# Altium schematic sheet MEGA2560_Rev3e_1.SchDoc: MEGA2560_Rev3e
size 409 x 289 mm; Origin: Eagle; Date: 23/01/2019 12:57:19; SheetNumber: 2; CODE-ARDUINO: DNP; DATASHEET: DNP; DISTRIBUTOR-LINK: DNP; DISTRIBUTOR-PN: DNP; MANUFACTURER: DNP; MANUFACTURER-PN: DNP; NOTE: DNP; Value: DNP; GateName_1: G$1; SymbolName_1: A3L-LOC; LibraryName: Arduino-utility; DeviceSetName: A3-FRAME; Sheet: Sheet:; ReferenceDesignsAREPROVIDED"ASIS"AND"WITHALLFAULTS.ArduinoSADISCLAIMSALLOTHERWARRANTIES,EXPRESSORIMPLIED,
REGARDINGPRODUCTS,INCLUDINGBUTNOTLIMITEDTO,ANYIMPLIEDWARRANTIESOFMERCHANTABILITYORFITNESSFORAPARTICULARPURPOSE

ArduinoSAmaymakechangestospecificationsandproductdescriptionsatanytime,withoutnotice.TheCustomermustnot
relyontheabsenceorcharacteristicsofanyfeaturesorinstructionsmarked"reserved"or"undefined."ArduinoSAreserves
theseforfuturedefinitionandshallhavenoresponsibilitywhatsoeverforconflictsorincompatibilitiesarisingfromfuturechangestothem.
TheproductinformationontheWebSiteorMaterialsissubjecttochangewithoutnotice.Donotfinalizeadesignwiththisinfo

ARDUINOandotherArduinobrandsandlogosandTrademarksofArduinoSA.AllArduinoSATrademarkscannotbeusedwithoutowner'sformalpermission: Reference Designs ARE PROVIDED "AS IS" AND "WITH ALL FAULTS. Arduino SA DISCLAIMS ALL OTHER WARRANTIES, EXPRESS OR IMPLIED, / REGARDING PRODUCTS, INCLUDING BUT NOT LIMITED TO, ANY IMPLIED WARRANTIES OF MERCHANTABILITY OR FITNESS FOR A PARTICULAR PURPOSE / Arduino SA may make changes to specifications and product descriptions at any time, without notice. The Customer must not / rely on the absence or characteristics of any features or instructions marked "reserved" or "undefined." Arduino SA reserves / these for future definition and shall have no responsibility whatsoever for conflicts or incompatibilities arising from future changes to them. / The product information on the Web Site or Materials is subject to change without notice. Do not finalize a design with this info / ARDUINO and other Arduino brands and logos and Trademarks of Arduino SA. All Arduino SA Trademarks cannot be used without owner's formal permission
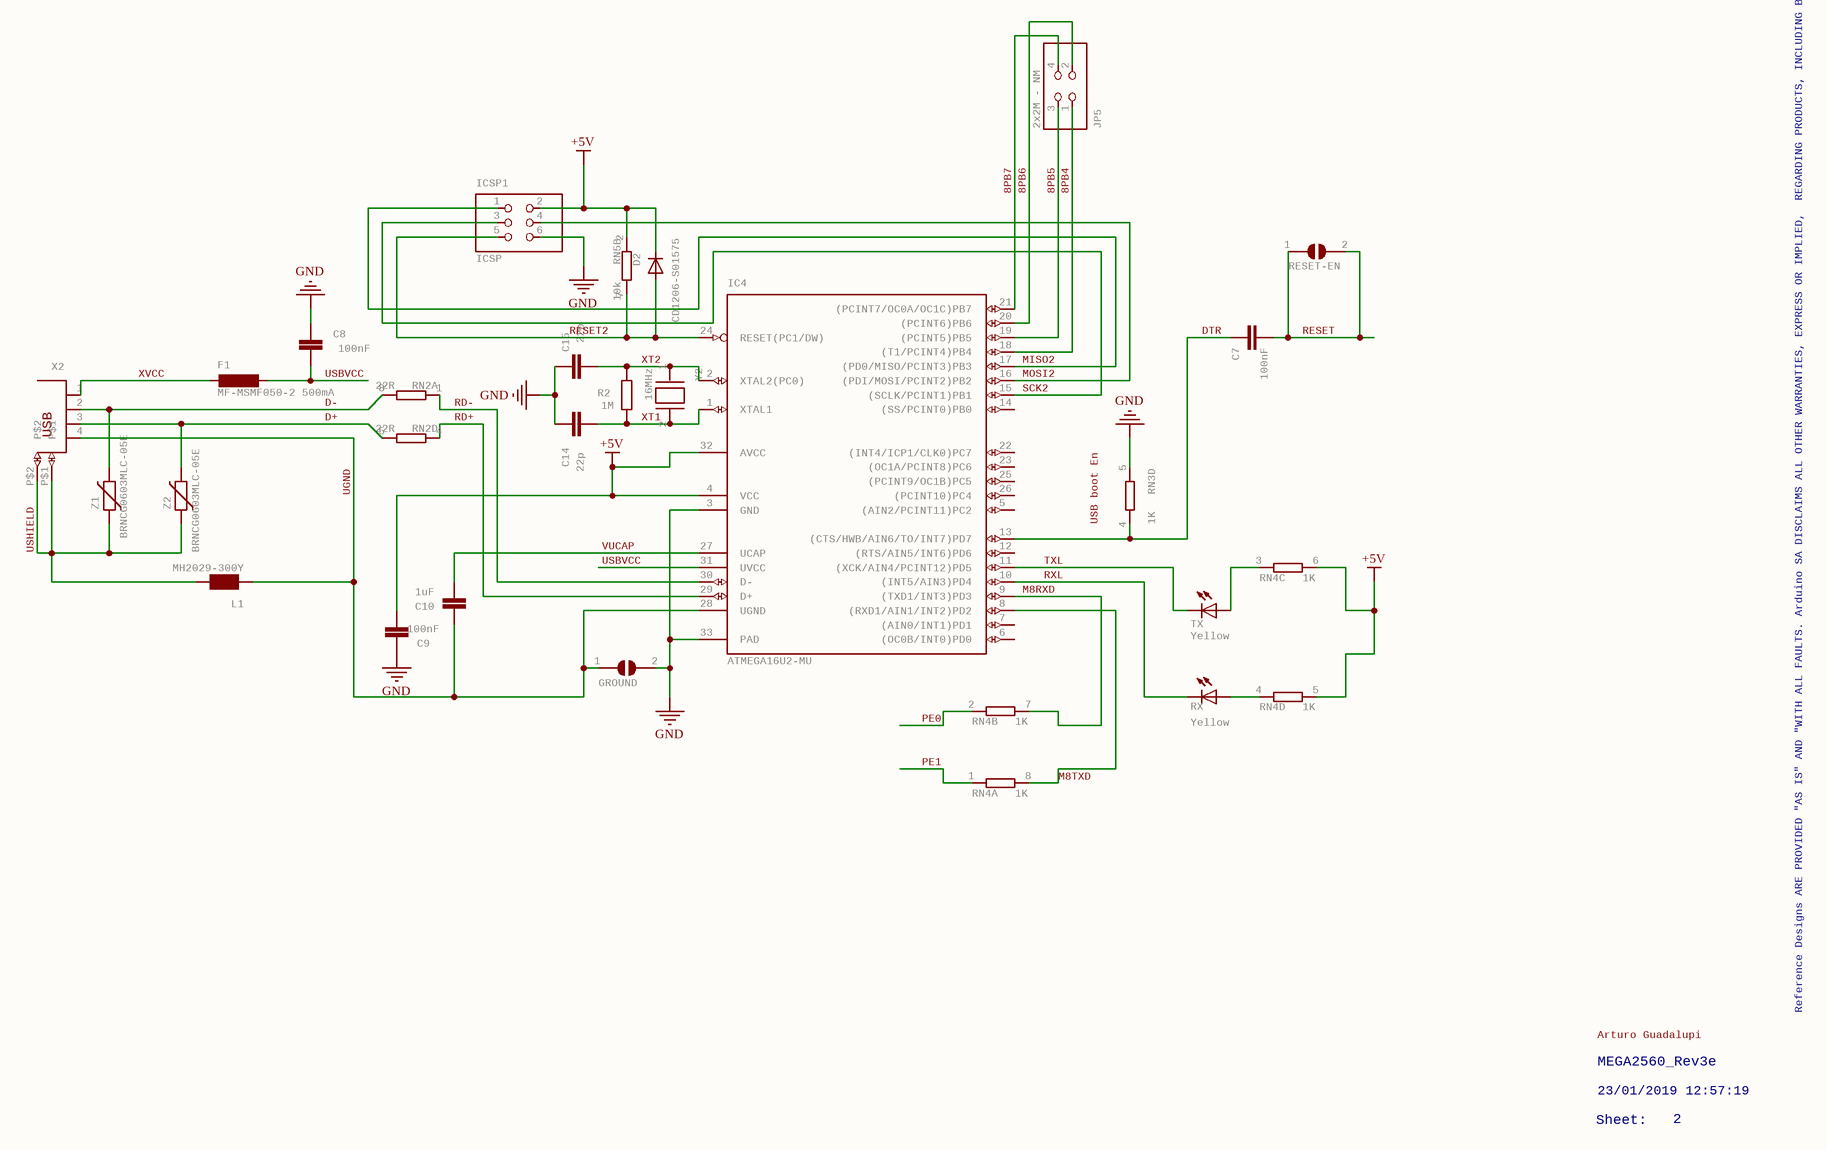
[diagram p0: MEGA2560_Rev3e_1.SchDoc]

## Parts
C7  100nF  [C0603-ROUND]
C8  100nF  [C0603-ROUND]
C9  100nF  [C0603-ROUND]
C10  1uF  [C0603-ROUND]
C14  22p  [C0603-ROUND]
C15  22p  [C0603-ROUND]
D2  CD1206-S01575  [MINIMELF]
F1  MF-MSMF050-2 500mA  [L1812]
GROUND  SJ  [SJ]  (value not drawn)
IC4  ATMEGA16U2-MU  [MLF32]
ICSP1  ICSP  [2X03]
JP5  2x2M - NM  [2X02]
L1  MH2029-300Y  [0805]
R2  1M  [R0603-ROUND]
RESET-EN  SJ  [SJ]  (value not drawn)
RN2  22R  [CAY16]  (parts A,D of 4)
RN3  1K  [CAY16]  (part D of 4)
RN4  1K  [CAY16]  (parts A,B,C,D of 4)
RN5  10k  [CAY16]  (part B of 4)
RX  Yellow  [CHIPLED_0805]
TX  Yellow  [CHIPLED_0805]
X2  0056_USB-B-S-RA-WT-SPCC  [PN61729]  (value not drawn)
Y2  16MHz  [QS]
Z1  BRNCG0603MLC-05E  [CT/CN0603]
Z2  BRNCG0603MLC-05E  [CT/CN0603]

## Nets
+5V: C9.1 D2.C IC4.4(VCC) IC4.32(AVCC) ICSP1.2 RN4.5 RN4.6 RN5.2
GND: C8.2 C9.2 C14.2 C15.2 GROUND.2 IC4.3(GND) IC4.33(PAD) ICSP1.6 RN3.5
8PB4: IC4.18((T1/PCINT4)PB4) JP5.1
8PB5: IC4.19((PCINT5)PB5) JP5.3
8PB6: IC4.20((PCINT6)PB6) JP5.2
8PB7: IC4.21((PCINT7/OC0A/OC1C)PB7) JP5.4
D+: RN2.5 X2.3 Z2.2
D-: RN2.8 X2.2 Z1.2
DTR: C7.1 IC4.13((CTS/HWB/AIN6/TO/INT7)PD7) RN3.4
M8RXD: IC4.9((TXD1/INT3)PD3) RN4.7
M8TXD: IC4.8((RXD1/AIN1/INT2)PD2) RN4.8
MISO2: IC4.17((PD0/MISO/PCINT3)PB3) ICSP1.1
MOSI2: IC4.16((PDI/MOSI/PCINT2)PB2) ICSP1.4
PE0: RN4.2
PE1: RN4.1
RD+: IC4.29(D+) RN2.4
RD-: IC4.30(D-) RN2.1
RESET: C7.2 RESET-EN.1 RESET-EN.2
RESET2: D2.A IC4.24(RESET(PC1/DW)) ICSP1.5 RN5.7
RXL: IC4.10((INT5/AIN3)PD4) RX.C
SCK2: IC4.15((SCLK/PCINT1)PB1) ICSP1.3
TXL: IC4.11((XCK/AIN4/PCINT12)PD5) TX.C
UGND: C10.2 GROUND.1 IC4.28(UGND) L1.1 X2.4
USBVCC: C8.1 F1.1 IC4.31(UVCC)
USHIELD: L1.2 X2.P$1 X2.P$2 Z1.1 Z2.1
VUCAP: C10.1 IC4.27(UCAP)
XT1: C14.1 IC4.1(XTAL1) R2.1 Y2.2
XT2: C15.1 IC4.2(XTAL2(PC0)) R2.2 Y2.1
XVCC: F1.2 X2.1
NetRN4_3: RN4.3 TX.A
NetRN4_4: RN4.4 RX.A

Not connected (* = marked no-connect by the designer): IC4 5((AIN2/PCINT11)PC2) 6((OC0B/INT0)PD0) 7((AIN0/INT1)PD1) 12((RTS/AIN5/INT6)PD6) 14((SS/PCINT0)PB0) 22((INT4/ICP1/CLK0)PC7) 23((OC1A/PCINT8)PC6) 25((PCINT9/OC1B)PC5) 26((PCINT10)PC4)

## Notes on the sheet
- (near RN3) USB boot En
- Reference Designs ARE PROVIDED "AS IS" AND "WITH ALL FAULTS. Arduino SA DISCLAIMS ALL OTHER WARRANTIES, EXPRESS OR IMPLIED,
  REGARDING PRODUCTS, INCLUDING BUT NOT LIMITED TO, ANY IMPLIED WARRANTIES OF MERCHANTABILITY OR FITNESS FOR A PARTICULAR PURPOSE
  Arduino SA may make changes to specifications and product descriptions at any time, without notice. The Customer must not
  rely on the absence or characteristics of any features or instructions marked "reserved" or "undefined." Arduino SA reserves
  these for future definition and shall have no responsibility whatsoever for conflicts or incompatibilities arising from future changes to them.
  The product information on the Web Site or Materials is subject to change without notice. Do not finalize a design with this info
  ARDUINO and other Arduino brands and logos and Trademarks of Arduino SA. All Arduino SA Trademarks cannot be used without owner's formal permission
- Arturo Guadalupi
- MEGA2560_Rev3e
- Sheet:
- 23/01/2019 12:57:19
- 2

## Library data of the parts
C7-C9 = 0015_100NF_0603: 100nF 0603 50V; PART_NUMBER: cl10b104kbnc; GateName_1: G$1; SymbolName_1: C-EU; MONTHLY_USAGE: _____; TYPE: Condensatori; LibraryName: Condensatori; DeviceSetName: 0015_100NF_0603; CASE: 0603; PRICE: _____; SUPPLIER: _____
C10 = 0006_1UF_0603/GRM188R61E105KA12D: 1uF 0603; GateName_1: G$1; SymbolName_1: C-EU; MONTHLY_USAGE: _____; TYPE: Condensatori; LibraryName: Condensatori; DeviceSetName: 0006_1UF_0603/GRM188R61E105KA12D; CASE: 0603; PART_NUMBER: 1uF_0603/GRM188R61E105KA12D; PRICE: _____; SUPPLIER: _____
C14 C15 = 0014_22PF_0603: 22pF 0603; GateName_1: G$1; SymbolName_1: C-EU; MONTHLY_USAGE: _____; TYPE: Condensatori; LibraryName: Condensatori; DeviceSetName: 0014_22PF_0603; CASE: 0603; PART_NUMBER: 22pF_0603; PRICE: _____; SUPPLIER: _____
D2 = 0012_CD1206-S01575: small-signal high-speed Switching Diodes   CD1206; GateName_1: G$1; SymbolName_1: D; MONTHLY_USAGE: _____; TYPE: Diodi; LibraryName: Diodi; DeviceSetName: 0012_CD1206-S01575; CASE: 1206; PART_NUMBER: CD1206-S01575; PRICE: _____; SUPPLIER: _____
F1 = 0002_MF-MSMF050-2: 500 mA Multifuse ï¿½ Polyfuse; GateName_1: G$1; SymbolName_1: L-EU; MONTHLY_USAGE: _____; TYPE: Protezione; LibraryName: Protezione; DeviceSetName: 0002_MF-MSMF050-2; CASE: CASE; PART_NUMBER: MF-MSMF050-2; PRICE: _____; SUPPLIER: _____
GROUND RESET-EN = SJ: SMD solder JUMPER; GateName_1: 1; SymbolName_1: SJ; LibraryName: jumper; DeviceSetName: SJ
IC4 = 0007_ATMEGA16U2-MUR: 8-bit Microcontroller with 16K Bytes of ISP Flash and USB Controller   ATMEGA16U2-MUR; GateName_1: G$1; SymbolName_1: ATMEL_MEGA8U2; MONTHLY_USAGE: _____; LibraryName: IntegratedCircuits; DeviceSetName: 0007_ATMEGA16U2-MUR; CASE: QFN32_5x5; PART_NUMBER: ATMEGA16U2-MUR; PRICE: _____; SUPPLIER: _____; TYPE: Circuito_Integrato
ICSP1 = 0114_PH254-203DF118A00V: 3x2 M V h 8,5 mm p2,54; GateName_1: A; SymbolName_1: PINH2X3; MONTHLY_USAGE: _____; LibraryName: Connettori; DeviceSetName: 0114_PH254-203DF118A00V; CASE: CASE; PART_NUMBER: PH254-203DF118A00V; PRICE: _____; SUPPLIER: _____; TYPE: Connettori
JP5 = PINHD-2X2: PIN HEADER; GateName_1: A; SymbolName_1: PINH2X2; LibraryName: SmartPrj; DeviceSetName: PINHD-2X2
L1 = 0001_BLM21PG300SN1D_/_MH2029-300Y: BLM21; GateName_1: G$1; SymbolName_1: L; MONTHLY_USAGE: _____; TYPE: Protezione; LibraryName: Protezione; DeviceSetName: 0001_BLM21PG300SN1D_/_MH2029-300Y; CASE: CASE; PART_NUMBER: BLM21PG300SN1D_/_MH2029-300Y; PRICE: _____; SUPPLIER: _____
R2 = 0004_0603_1M: 1M 0603; GateName_1: G$1; SymbolName_1: R-EU; MONTHLY_USAGE: _____; LibraryName: Resistenze; DeviceSetName: 0004_0603_1M; CASE: 0603; PART_NUMBER: 0603_1M; PRICE: _____; SUPPLIER: _____; TYPE: Resistenze
RN2 = 0003_064R_22R_/_CAY16-220J4LF: 22R 064R; GateName_1: A; SymbolName_1: R1NV; GateName_2: B; GateName_3: C; GateName_4: D; MONTHLY_USAGE: _____; SymbolName_2: R1NV; SymbolName_3: R1NV; SymbolName_4: R1NV; LibraryName: Resistenze; DeviceSetName: 0003_064R_22R_/_CAY16-220J4LF; CASE: SMD_3,2x1,6; PART_NUMBER: 064R_22R_/_CAY16-220J4LF; PRICE: _____; SUPPLIER: _____; TYPE: Resistenze
RN3 RN4 = 0005_064R_1K_/_CAY16-102J4LF: 1K 064R; GateName_1: A; SymbolName_1: R1NV; GateName_2: B; GateName_3: C; GateName_4: D; MONTHLY_USAGE: _____; SymbolName_2: R1NV; SymbolName_3: R1NV; SymbolName_4: R1NV; LibraryName: Resistenze; DeviceSetName: 0005_064R_1K_/_CAY16-102J4LF; CASE: SMD_3,2x1,6; PART_NUMBER: 064R_1K_/_CAY16-102J4LF; PRICE: _____; SUPPLIER: _____; TYPE: Resistenze
RN5 = 0016_064R_10K_/_CAY16-103J4LF: 10K 064 R; GateName_1: A; SymbolName_1: R1NV; GateName_2: B; GateName_3: C; GateName_4: D; MONTHLY_USAGE: _____; SymbolName_2: R1NV; SymbolName_3: R1NV; SymbolName_4: R1NV; LibraryName: Resistenze; DeviceSetName: 0016_064R_10K_/_CAY16-103J4LF; CASE: SMD_3,2x1,6; PART_NUMBER: 064R_10K_/_CAY16-103J4LF; PRICE: _____; SUPPLIER: _____; TYPE: Resistenze
RX TX = 0044_KPT-2012YC: LED YELLOW - SMD - 0805; GateName_1: G$1; MONTHLY_USAGE: _____; SymbolName_1: LED; LibraryName: Opto; DeviceSetName: 0044_KPT-2012YC; CASE: CASE; PART_NUMBER: KPT-2012YC; PRICE: _____; SUPPLIER: _____; TYPE: Opto
X2 = 0056_USB-B-S-RA-WT-SPCC: USB - B; GateName_1: G$1; SymbolName_1: J11; MONTHLY_USAGE: _____; LibraryName: Connettori; DeviceSetName: 0056_USB-B-S-RA-WT-SPCC; USB: USB; CASE: CASE; PART_NUMBER: USB-B-S-RA-WT-SPCC; PRICE: _____; SUPPLIER: _____; TYPE: Connettori
Y2 = 0019_P011052006_16M: 16MHz THT; PART_NUMBER: P011052006 16M/FTX16M20S; GateName_1: G$1; SymbolName_1: XTAL; LibraryName: Cristalli; DeviceSetName: 0019_P011052006_16M; CASE: CASE; TYPE: Cristalli
Z1 Z2 = 0010_BRNCG0603MLC-05E: CG0603MLC-05E; GateName_1: G$1; SymbolName_1: VARISTOR; MONTHLY_USAGE: _____; LibraryName: Protezione; DeviceSetName: 0010_BRNCG0603MLC-05E; CASE: CASE; PART_NUMBER: BRNCG0603MLC-05E; PRICE: _____; SUPPLIER: _____; TYPE: Protezione